# Altium schematic sheet STM32F429ZI.SchDoc: STM32F429ZI
size A3; Revision: 1.0; SheetNumber: 3; SheetTotal: 7
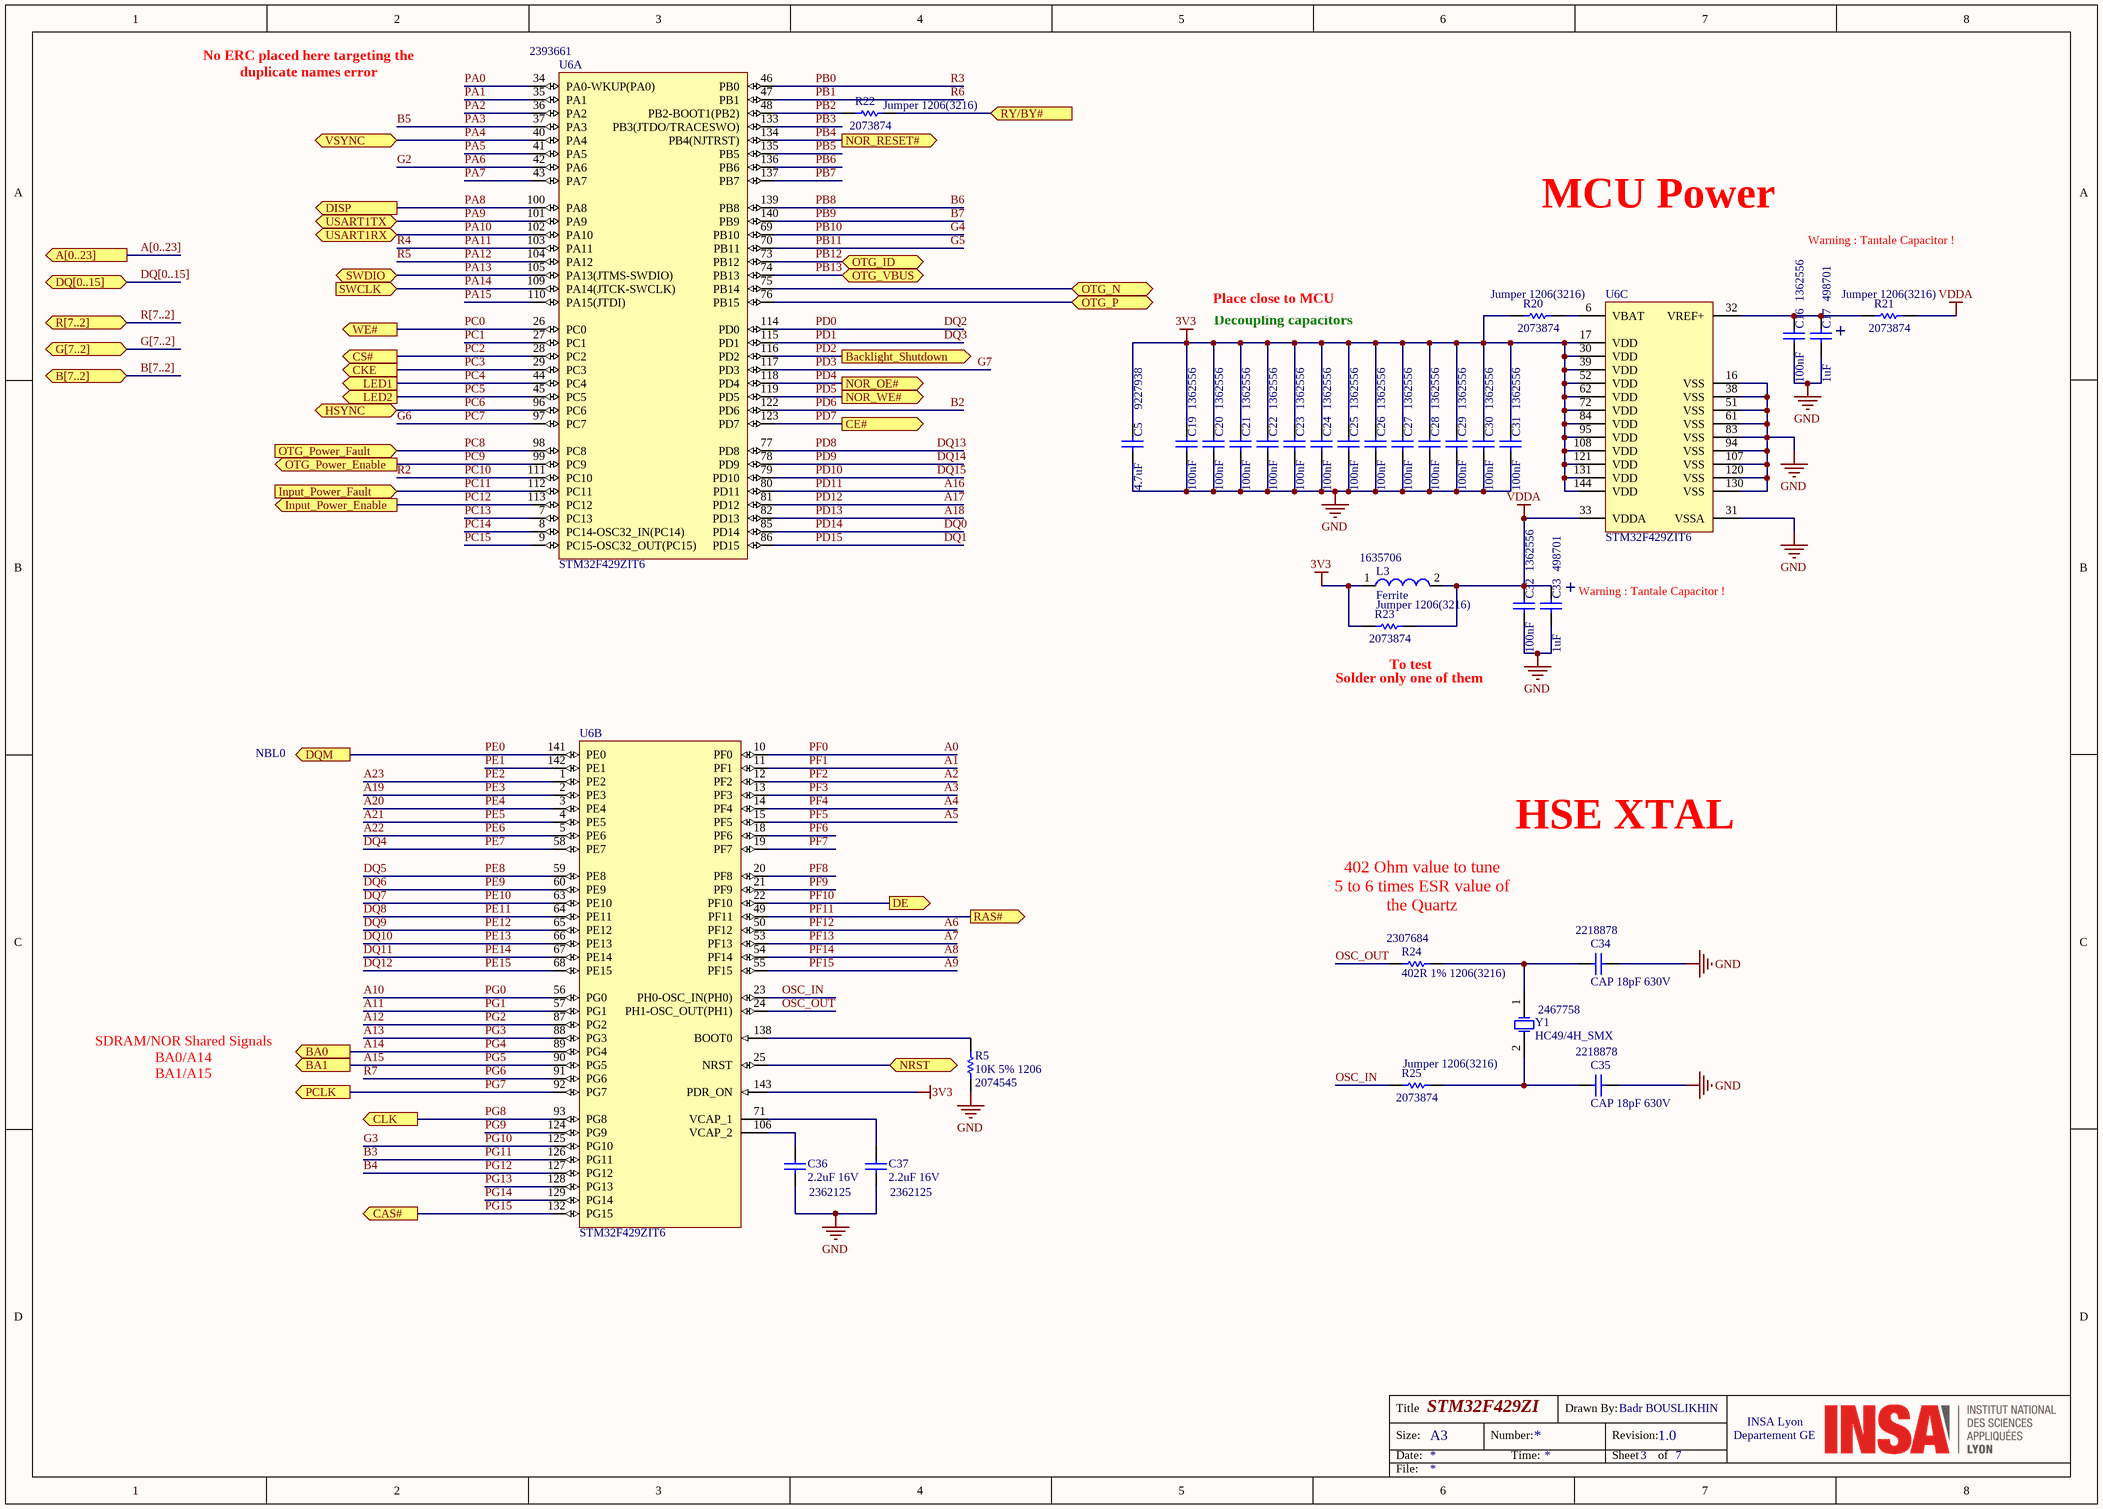
[diagram p0: STM32F429ZI.SchDoc]

## Parts
C5  4.7uF  Supplier Part Number 1: 9227938  [CAPC1206(3216)190_N]
C16  100nF  Supplier Part Number 1: 1362556  [CAPC0603(1608)100_N]
C17  1uF  Supplier Part Number 1: 498701  [CAPC1206(3216)170_L]
C19  100nF  Supplier Part Number 1: 1362556  [CAPC0603(1608)100_N]
C20  100nF  Supplier Part Number 1: 1362556  [CAPC0603(1608)100_N]
C21  100nF  Supplier Part Number 1: 1362556  [CAPC0603(1608)100_N]
C22  100nF  Supplier Part Number 1: 1362556  [CAPC0603(1608)100_N]
C23  100nF  Supplier Part Number 1: 1362556  [CAPC0603(1608)100_N]
C24  100nF  Supplier Part Number 1: 1362556  [CAPC0603(1608)100_N]
C25  100nF  Supplier Part Number 1: 1362556  [CAPC0603(1608)100_N]
C26  100nF  Supplier Part Number 1: 1362556  [CAPC0603(1608)100_N]
C27  100nF  Supplier Part Number 1: 1362556  [CAPC0603(1608)100_N]
C28  100nF  Supplier Part Number 1: 1362556  [CAPC0603(1608)100_N]
C29  100nF  Supplier Part Number 1: 1362556  [CAPC0603(1608)100_N]
C30  100nF  Supplier Part Number 1: 1362556  [CAPC0603(1608)100_N]
C31  100nF  Supplier Part Number 1: 1362556  [CAPC0603(1608)100_N]
C32  100nF  Supplier Part Number 1: 1362556  [CAPC0603(1608)100_N]
C33  1uF  Supplier Part Number 1: 498701  [CAPC1206(3216)170_L]
C34  CAP 18pF 630V  Supplier Part Number 1: 2218878  [CAPC1206(3216)170_L]
C35  CAP 18pF 630V  Supplier Part Number 1: 2218878  [CAPC1206(3216)170_L]
C36  2.2uF 16V  Supplier Part Number 1: 2362125  [CAPC1206(3216)190_L]
C37  2.2uF 16V  Supplier Part Number 1: 2362125  [CAPC1206(3216)190_L]
L3  Ferrite  Supplier Part Number 1: 1635706  [SMD-0603]
R5  10K 5% 1206  Supplier Part Number 1: 2074545  [RESC1206(3216)_M]
R20  Jumper 1206(3216)  Supplier Part Number 1: 2073874  [RESC1206(3216)_L]
R21  Jumper 1206(3216)  Supplier Part Number 1: 2073874  [RESC1206(3216)_L]
R22  Jumper 1206(3216)  Supplier Part Number 1: 2073874  [RESC1206(3216)_L]
R23  Jumper 1206(3216)  Supplier Part Number 1: 2073874  [RESC1206(3216)_L]
R24  402R 1% 1206(3216)  Supplier Part Number 1: 2307684  [RESC1206(3216)_L]
R25  Jumper 1206(3216)  Supplier Part Number 1: 2073874  [RESC1206(3216)_L]
U6  STM32F429ZIT6  Supplier Part Number 1: 2393661  [STM-LQFP144_L]  (parts A,B,C of 3)
Y1  HC49/4H_SMX  Supplier Part Number 1: 2467758  [HC49/4H_SMX]

## Ports
A[0..23] (out), B[7..2], BA0 (out), BA1 (out), Backlight_Shutdown (out), CAS# (out), CE# (out), CKE (out), CLK (out), CS# (out), DE (out), DISP (out), DQ[0..15] (bidir), DQM (out), G[7..2], HSYNC, Input_Power_Enable (out), Input_Power_Fault (in), LED1 (out), LED2 (out), NOR_OE# (out), NOR_RESET# (out), NOR_WE# (out), NRST (bidir), OTG_ID (bidir), OTG_N (bidir), OTG_P (bidir), OTG_Power_Enable (out), OTG_Power_Fault (in), OTG_VBUS (bidir), PCLK (out), R[7..2], RAS# (out), RY/BY# (in), SWCLK (in), SWDIO (bidir), USART1RX, USART1TX, VSYNC, WE# (out)

## Nets
3V3: C5.2 C19.2 C20.2 C21.2 C22.2 C23.2 C24.2 C25.2 C26.2 C27.2 C28.2 C29.2 C30.2 C31.2 L3.1 R20.1 R23.1 U6.17(VDD) U6.30(VDD) U6.39(VDD) U6.52(VDD) U6.62(VDD) U6.72(VDD) U6.84(VDD) U6.95(VDD) U6.108(VDD) U6.121(VDD) U6.131(VDD) U6.143(PDR_ON) U6.144(VDD)
GND: C5.1 C16.1 C17.1 C19.1 C20.1 C21.1 C22.1 C23.1 C24.1 C25.1 C26.1 C27.1 C28.1 C29.1 C30.1 C31.1 C32.1 C33.1 C34.2 C35.2 C36.1 C37.1 R5.1 U6.16(VSS) U6.31(VSSA) U6.38(VSS) U6.51(VSS) U6.61(VSS) U6.83(VSS) U6.94(VSS) U6.107(VSS) U6.120(VSS) U6.130(VSS)
VDDA: C32.2 C33.2 L3.2 R21.2 R23.2 U6.33(VDDA)
A0: U6.10(PF0)  [also labelled PF0]
A1: U6.11(PF1)  [also labelled PF1]
A2: U6.12(PF2)  [also labelled PF2]
A3: U6.13(PF3)  [also labelled PF3]
A4: U6.14(PF4)  [also labelled PF4]
A5: U6.15(PF5)  [also labelled PF5]
A6: U6.50(PF12)  [also labelled PF12]
A7: U6.53(PF13)  [also labelled PF13]
A8: U6.54(PF14)  [also labelled PF14]
A9: U6.55(PF15)  [also labelled PF15]
A10: U6.56(PG0)  [also labelled PG0]
A11: U6.57(PG1)  [also labelled PG1]
A12: U6.87(PG2)  [also labelled PG2]
A13: U6.88(PG3)  [also labelled PG3]
A14: U6.89(PG4) ; port BA0  [also labelled PG4]
A15: U6.90(PG5) ; port BA1  [also labelled PG5]
A16: U6.80(PD11)  [also labelled PD11]
A17: U6.81(PD12)  [also labelled PD12]
A18: U6.82(PD13)  [also labelled PD13]
A19: U6.2(PE3)  [also labelled PE3]
A20: U6.3(PE4)  [also labelled PE4]
A21: U6.4(PE5)  [also labelled PE5]
A22: U6.5(PE6)  [also labelled PE6]
A23: U6.1(PE2)  [also labelled PE2]
B2: U6.122(PD6)  [also labelled PD6]
B3: U6.126(PG11)  [also labelled PG11]
B4: U6.127(PG12)  [also labelled PG12]
B5: U6.37(PA3)  [also labelled PA3]
B6: U6.139(PB8)  [also labelled PB8]
B7: U6.140(PB9)  [also labelled PB9]
DQ0: U6.85(PD14)  [also labelled PD14]
DQ1: U6.86(PD15)  [also labelled PD15]
DQ2: U6.114(PD0)  [also labelled PD0]
DQ3: U6.115(PD1)  [also labelled PD1]
DQ4: U6.58(PE7)  [also labelled PE7]
DQ5: U6.59(PE8)  [also labelled PE8]
DQ6: U6.60(PE9)  [also labelled PE9]
DQ7: U6.63(PE10)  [also labelled PE10]
DQ8: U6.64(PE11)  [also labelled PE11]
DQ9: U6.65(PE12)  [also labelled PE12]
DQ10: U6.66(PE13)  [also labelled PE13]
DQ11: U6.67(PE14)  [also labelled PE14]
DQ12: U6.68(PE15)  [also labelled PE15]
DQ13: U6.77(PD8)  [also labelled PD8]
DQ14: U6.78(PD9)  [also labelled PD9]
DQ15: U6.79(PD10)  [also labelled PD10]
G2: U6.42(PA6)  [also labelled PA6]
G3: U6.125(PG10)  [also labelled PG10]
G4: U6.69(PB10)  [also labelled PB10]
G5: U6.70(PB11)  [also labelled PB11]
G6: U6.97(PC7)  [also labelled PC7]
G7: U6.117(PD3)  [also labelled PD3]
NRST: U6.25(NRST) ; port NRST
OSC_IN: R25.1 U6.23(PH0-OSC_IN(PH0))
OSC_OUT: R24.1 U6.24(PH1-OSC_OUT(PH1))
OTG_N: U6.75(PB14) ; port OTG_N
OTG_P: U6.76(PB15) ; port OTG_P
PA0: U6.34(PA0-WKUP(PA0))
PA1: U6.35(PA1)
PA2: U6.36(PA2)
PA4: U6.40(PA4) ; port VSYNC
PA5: U6.41(PA5)
PA7: U6.43(PA7)
PA8: U6.100(PA8) ; port DISP
PA9: U6.101(PA9) ; port USART1TX
PA10: U6.102(PA10) ; port USART1RX
PA11: U6.103(PA11)  [also labelled R4]
PA12: U6.104(PA12)  [also labelled R5]
PA13: U6.105(PA13(JTMS-SWDIO)) ; port SWDIO
PA14: U6.109(PA14(JTCK-SWCLK)) ; port SWCLK
PA15: U6.110(PA15(JTDI))
PB0: U6.46(PB0)  [also labelled R3]
PB1: U6.47(PB1)  [also labelled R6]
PB2: R22.1 U6.48(PB2-BOOT1(PB2))
PB3: U6.133(PB3(JTDO/TRACESWO))
PB4: U6.134(PB4(NJTRST)) ; port NOR_RESET#
PB5: U6.135(PB5)
PB6: U6.136(PB6)
PB7: U6.137(PB7)
PB12: U6.73(PB12) ; port OTG_ID
PB13: U6.74(PB13) ; port OTG_VBUS
PC0: U6.26(PC0) ; port WE#
PC1: U6.27(PC1)
PC2: U6.28(PC2) ; port CS#
PC3: U6.29(PC3) ; port CKE
PC4: U6.44(PC4) ; port LED1
PC5: U6.45(PC5) ; port LED2
PC6: U6.96(PC6) ; port HSYNC
PC8: U6.98(PC8) ; port OTG_Power_Fault
PC9: U6.99(PC9) ; port OTG_Power_Enable
PC10: U6.111(PC10)  [also labelled R2]
PC11: U6.112(PC11) ; port Input_Power_Fault
PC12: U6.113(PC12) ; port Input_Power_Enable
PC13: U6.7(PC13)
PC14: U6.8(PC14-OSC32_IN(PC14))
PC15: U6.9(PC15-OSC32_OUT(PC15))
PD2: U6.116(PD2) ; port Backlight_Shutdown
PD4: U6.118(PD4) ; port NOR_OE#
PD5: U6.119(PD5) ; port NOR_WE#
PD7: U6.123(PD7) ; port CE#
PE0: U6.141(PE0) ; port DQM
PE1: U6.142(PE1)
PF6: U6.18(PF6)
PF7: U6.19(PF7)
PF8: U6.20(PF8)
PF9: U6.21(PF9)
PF10: U6.22(PF10) ; port DE
PF11: U6.49(PF11) ; port RAS#
PG6: U6.91(PG6)  [also labelled R7]
PG7: U6.92(PG7) ; port PCLK
PG8: U6.93(PG8) ; port CLK
PG9: U6.124(PG9)
PG13: U6.128(PG13)
PG14: U6.129(PG14)
PG15: U6.132(PG15) ; port CAS#
RY/BY#: R22.2 ; port RY/BY#
NetC16_2: C16.2 C17.2 R21.1 U6.32(VREF+)
NetC34_1: C34.1 R24.2 Y1.1(OSC1)
NetC35_1: C35.1 R25.2 Y1.2(OSC2)
NetC36_2: C36.2 U6.106(VCAP_2)
NetC37_2: C37.2 U6.71(VCAP_1)
NetR5_2: R5.2 U6.138(BOOT0)
NetR20_2: R20.2 U6.6(VBAT)

## Buses and harness runs
bus A[0..23] = port A[0..23]
bus B[7..2] = port B[7..2]
bus DQ[0..15] = port DQ[0..15]
bus G[7..2] = port G[7..2]
bus R[7..2] = port R[7..2]

## Notes on the sheet
- No ERC placed here targeting the duplicate names error
- MCU Power
- Warning : Tantale Capacitor !
- Place close to MCU
- Decoupling capacitors
- (near C17) +
- (near C33) +
- (near C33) Warning : Tantale Capacitor !
- Solder only one of them
- (near R23) To test
- NBL0
- HSE XTAL
- (near R24) 402 Ohm value to tune
  5 to 6 times ESR value of the Quartz
- SDRAM/NOR Shared Signals
  BA0/A14
  BA1/A15
- Title
- Size:
- Date:
- A3
- Number:
- Time:
- Drawn By:
- Revision:
- Sheet
- Badr BOUSLIKHIN
- of
- Departement GE
- INSA Lyon
- File:

## Library data of the parts
C5 = CMP-1037-04923-1: CAP 4.7uF 50V ±10% 1206 (3216 Metric) Thickness 1.9mm SMD; Case-EIA: 1206; Case-Metric: 3216; Technology: SMT; Rated Voltage: 50 V; Max Thickness: 1.9 mm; Value: 4.7uF; Tolerance: ±10%; Supplier 1: Farnell
C16 C19-C32 = CMP-1035-02592-1: CAP 100nF 50V ±10% 0603 (1608 Metric) Thickness 1mm SMD; Case-EIA: 0603; Case-Metric: 1608; Technology: SMT; Rated Voltage: 50 V; Max Thickness: 1 mm; Tolerance: ±10%; Value: 100nF; Supplier 1: Farnell
C17 C33 = CMP-1037-04687-1: CAP 1uF 16V ±10% 1206 (3216 Metric) Thickness 1.7mm SMD; Case-EIA: 1206; Case-Metric: 3216; Rated Voltage: 16 V; Max Thickness: 1.7 mm; Technology: SMT; Tolerance: ±10%; Value: 1uF; Supplier 1: Farnell
C34 C35 = CMP-1037-00919-1: CAP 18pF 500V ±5% 1206 (3216 Metric) Thickness 1.7mm SMD; Case-EIA: 1206; Case-Metric: 3216; Rated Voltage: 630 V; Value: 18pF; Tolerance: ±5%; Max Thickness: 1.7 mm; Technology: SMT; Supplier 1: Farnell
C36 C37 = CMP-1037-04816-1: CAP 2.2uF 16V ±20% 1206 (3216 Metric) Thickness 1.9mm SMD; Case-EIA: 1206; Case-Metric: 3216; Max Thickness: 1.9 mm; Rated Voltage: 16 V; Tolerance: ±20%; Technology: SMT; Value: 2.2uF; Supplier 1: Farnell
L3 = CMP-0220-00181-1: SMD EMI Suppression Ferrite Bead WE-CBF, Z = 600 Ohm; Impedance: 600 Ohm; PackageReference: SMD-0603; PackageVersion: 2009; ComponentLink2Description: Datasheet; ComponentLink1Description: Manufacturer Link; ComponentLink2URL: http://www.we-online.de/katalog/media/pdf/742792651.pdf; DatasheetVersion: Dec-2005; ComponentLink1URL: http://www.we-online.com; PackageDescription: Chip Inductor, 2-Leads, Body 1.6 x 0.8 mm; Supplier 1: Farnell
R5 = CMP-1014-00098-1: 10K 0.25W 5% 1206 (3216 Metric)  SMD; Manufacturer: YAGEO (PHYCOMP); Manufacturer Part Number: RC1206JR-0710KL; Value: 10000.00 Ohm; Case-Metric: 3216; Case-EIA: 1206; Power: 0.25 W; Tolerance: 5 %; Technology: SMT; RoHS: YES; ComponentLink1URL: http://www.farnell.com/datasheets/444357.pdf; ComponentLink1Description: http://www.farnell.com/datasheets/444357.pdf; ComponentLink2URL: http://www.farnell.com/cad/1539272.zip; ComponentLink2Description: http://www.farnell.com/cad/1539272.zip; Supplier 1: Farnell
R20-R23 R25 = CMP-1014-00001-1: Jumper 1206 (3216 Metric); Tolerance: None; Case-EIA: 1206; Case-Metric: 3216; Value: 0.00 Ohm; Technology: SMT; Power: None; Supplier 1: Farnell
R24 = CMP-1014-00465-1: 402R 0.25W 1% 1206 (3216 Metric)  SMD; Case-EIA: 1206; Case-Metric: 3216; Value: 402.00 Ohm; Technology: SMT; Power: 0.25 W; Tolerance: 1 %; Supplier 1: Farnell
U6 = CMP-0243-00051-2: ARM Cortex-M4 32-bit MCU+FPU, 225 DMIPS, 2048 kB Flash, 256 kB Internal RAM, 114 I/Os, 144-pin LQFP, -40 to 85 degC, Tray; Manufacturer: STMicroelectronics; I/Os (High Current): 114; Supply Voltage(Vcc) min (V): 1.8; Internal RAM Size (kB): 256; Supply Voltage(Vcc) max (V): 3.6; Operating Frequency(F) (Processor speed) (MHz): 180; D/A Converter: 2x12-bit; FLASH Size (Prog) (kB): 2048; DatasheetVersion: Rev. 2; PackageReference: LQFP144; ComponentLink2URL: http://www.st.com/st-web-ui/static/active/en/resource/technical/document/data_brief/DM00053488.pdf; PartNumber: STM32F429ZIT6; PackageVersion: Rev. 4, 06/2013; ComponentLink3URL: http://www.st.com/st-web-ui/static/active/en/resource/technical/document/datasheet/DM00037051.pdf; Packing: Tray; Mounting Technology: Surface Mount; ComponentLink3Description: Package Specification; ComponentLink1Description: Manufacturer URL; Core: ARM Cortex-M4; ComponentLink1URL: http://www.st.com/web/en/home.html; ComponentLink2Description: Datasheet; PackageDescription: 144-Pin Low Profile Quad Flat Package, 20 x 20 mm Body, 0.5 mm Pitch; PartId: 1; Supplier 1: Farnell
Y1 = HC49/4H_SMX: Surface Mount Quartz Crystal; Note: PCB layout complies with manufacturer's recommendation.; Published: 17-Jul-2002; DatasheetDocument: 18-Oct-1999; PackageDocument: 18-Oct-1999; PackageReference: HC49/4H_SMX; Publisher: Altium Limited; ComponentLink1Description: Manufacturer Link; ComponentLink1URL: http://www.cmac.com/mt/; ComponentLink2Description: Datasheet; ComponentLink2URL: http://www.cmac.com/mt/databook/crystals/smd/hc49_4h_smx.pdf; Supplier 1: Farnell